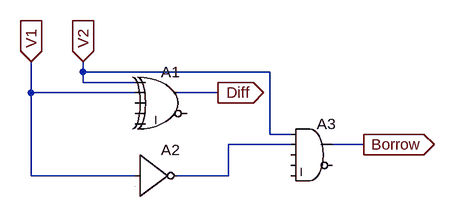
[diagram p0: schematic HS.asc]
HS.asc, the LTspice schematic file:
Version 4
SHEET 1 880 680
WIRE 64 96 64 80
WIRE 352 96 64 96
WIRE 64 112 64 96
WIRE 144 112 64 112
WIRE -16 128 -16 80
WIRE 144 128 -16 128
WIRE 272 128 208 128
WIRE 352 192 352 96
WIRE 384 192 352 192
WIRE 384 208 288 208
WIRE 496 208 448 208
WIRE -16 256 -16 128
WIRE 144 256 -16 256
WIRE 288 256 288 208
WIRE 288 256 208 256
FLAG -16 80 V1
IOPIN -16 80 In
FLAG 64 80 V2
IOPIN 64 80 In
FLAG 272 128 Diff
IOPIN 272 128 Out
FLAG 496 208 Borrow
IOPIN 496 208 Out
SYMBOL Digital\\xor 192 80 R0
SYMATTR InstName A1
SYMBOL Digital\\inv 144 192 R0
SYMATTR InstName A2
SYMBOL Digital\\and 416 160 R0
SYMATTR InstName A3

The netlist it stands for:
* HS.asc
A1 V2 V1 0 0 0 0 Diff 0 XOR
A2 V1 0 0 0 0 N001 0 0 BUF
A3 V2 N001 0 0 0 0 Borrow 0 AND
.backanno
.end